# Altium schematic sheet Pwr management.SchDoc: Power management
size A4; CheckedBy: none; Organization: ORGANIZATION; Address1: ADDRESS 1; Address2: ADDRESS 2; Address3: ADDRESS 3; Address4: ADDRESS 4; Revision: -; SheetNumber: 2; SheetTotal: 5; ENG_APP_DATE: --/--/--; DSN_APP_DATE: --/--/--; CHK_APP_DATE: --/--/--
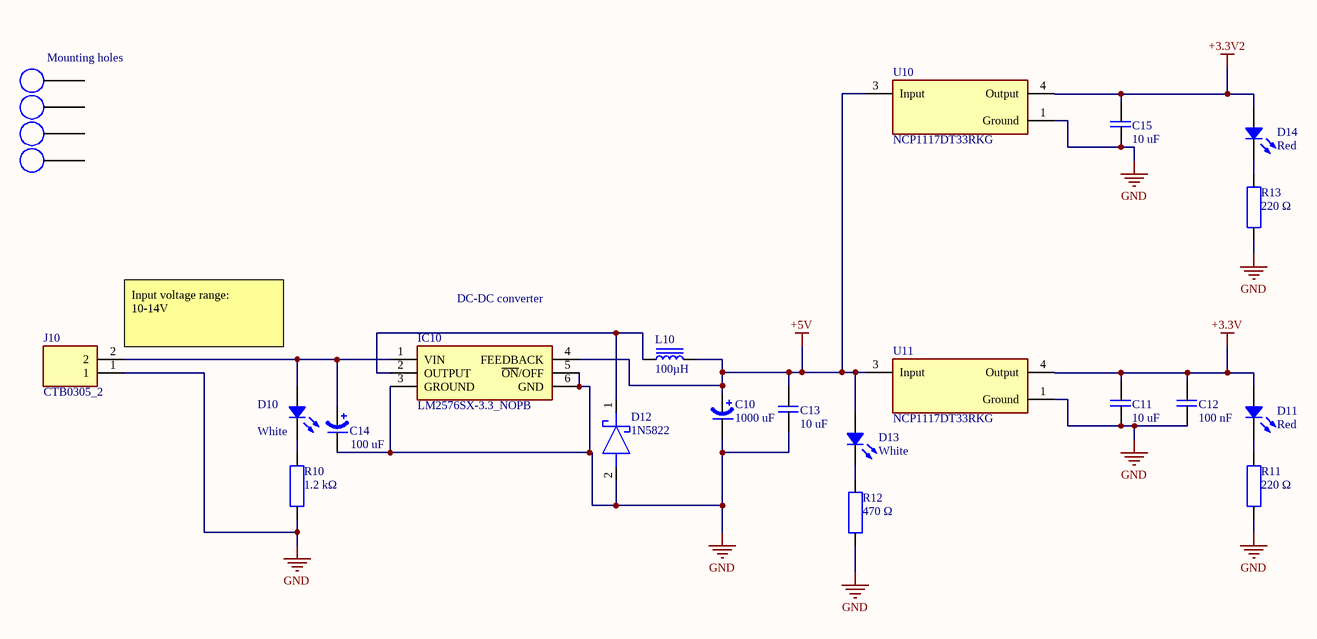
[diagram p0: Pwr management.SchDoc]

## Parts
C10  1000 uF  [Radial 13x20]
C11  10 uF  [1210 MLCC]
C12  100 nF  [1206 MLCC]
C13  10 uF  [1210 MLCC]
C14  100 uF  [RADIAL 8x11]
C15  10 uF  [1210 MLCC]
D10  White  [LED 1206_3216]
D11  Red  [LED 1206_3216]
D12  1N5822  [DIOAD2984W132L952D508]
D13  White  [LED 1206_3216]
D14  Red  [LED 1206_3216]
IC10  LM2576SX-3.3_NOPB  [KTT0005B]
J10  CTB0305_2  [CTB03052]
L10  100µH  [TDK SLF12575]
MH10  MH  [MH]  (value not drawn)  (no BOM)
MH11  MH  [MH]  (value not drawn)  (no BOM)
MH12  MH  [MH]  (value not drawn)  (no BOM)
MH13  MH  [MH]  (value not drawn)  (no BOM)
R10  1.2 kΩ  [1206 RES]
R11  220 Ω  [1206 RES]
R12  470 Ω  [1206 RES]
R13  220 Ω  [1206 RES]
U10  NCP1117DT33RKG  [FP-369C-MFG]
U11  NCP1117DT33RKG  [FP-369C-MFG]

## Nets
+3.3V: C11.2 C12.2 D11.1 U11.4(Output)
+3.3V2: C15.2 D14.1 U10.4(Output)
+5V: C10.1 C13.2 D13.1 IC10.4(FEEDBACK) L10.2 U10.3(Input) U11.3(Input)
GND: C10.2 C11.1 C12.1 C13.1 C14.2 C15.1 D12.2(A) IC10.3(GROUND) IC10.5(~{ON}/OFF) IC10.6(GND) J10.1 R10.2 R11.2 R12.2 R13.2 U10.1(Ground) U11.1(Ground)
NetC14_1: C14.1 D10.1 IC10.1(VIN) J10.2
NetD10_2: D10.2 R10.1
NetD11_2: D11.2 R11.1
NetD12_1: D12.1(K) IC10.2(OUTPUT) L10.1
NetD13_2: D13.2 R12.1
NetD14_2: D14.2 R13.1

Not connected (* = marked no-connect by the designer): MH10 1; MH11 1; MH12 1; MH13 1

## Notes on the sheet
- (near MH11) Mounting holes
- (near IC10) DC-DC converter
- (near J10) Input voltage range:
  10-14V
- Project:
- Title:
- Drawn by:
- Date and time:
- Checked by:
- Budapest University of Technology and Economics
- Faculty of Electrical Engineering and Informatics
- Sheet
- of
- Size:
- A4
- Revision:

## Library data of the parts
C10 C14 = Elco: Electrolytic capacitor
  C10: Value: 1000 uF
  C14: Value: 100 uF
C11-C13 C15 = Capacitor: Generic MLCC; Manufacturer article no.: *
  C11 C13 C15: Value: 10 uF
  C12: Value: 100 nF
D10 D11 D13 D14 = LTW-C230DS: LED WHITE 1206 SMD; Manufacturer: Lite-On Inc.; Configuration: Independent; Current - Test: 20mA; Lens Color: Yellow; Lens Size: 1.50mm x 1.60mm; Lens Style: Rectangle with Flat Top; Millicandela Rating: 315mcd; Viewing Angle: 130°; Voltage - Forward (Vf) (Typ): 3.2V; Part Number: LTW-C230DS; ComponentLink1Description: Datasheet; ComponentLink1URL: http://optoelectronics.liteon.com/upload/download/DS22-2007-0232/LTW-C230DS.pdf; ComponentLink2Description: DigiKey Link; ComponentLink2URL: http://digikey.com/product-detail/en/lite-on-inc/LTW-C230DS/160-2221-1-ND/7597462; Device Package: 1206 (3216 Metric); Height (Max): 1.10mm; LastUpdated: 2020. 09. 02. 1:22:59; Lifecycle Status: Active; Minimum Order: 1; Mounting Type: Surface Mount; Package / Case: 1206 (3216 Metric); Packaging: TapeAndReel; PartId: 933; Part Status: Active; Price: 0.13; Series: -; Size / Dimension: 3.20mm L x 1.60mm W; Supplier 1: DigiKey; Supplier Part Number 1: 160-2221-1-ND; Supplier Device Package: 1206
  D10 D13: Color: White; Value: White
  D11: Color: Red; Value: Red
  D14: Color: White; Value: Red
D12 = 1N5822: Schottky Diode; Manufacturer_Name: NEUTRAL; Datasheet Link: http://uk.rs-online.com/web/p/products/1124393; Manufacturer_Part_Number: 1N5822
IC10 = LM2576SX-3.3_NOPB: Integrated Circuit; Manufacturer_Name: Texas Instruments; Manufacturer_Part_Number: LM2576SX-3.3/NOPB; Datasheet Link: http://www.ti.com/lit/gpn/lm2576; Mouser Part Number: 926-LM2576SX33NOPB; Mouser Price/Stock: https://www.mouser.co.uk/ProductDetail/Texas-Instruments/LM2576SX-33-NOPB/?qs=X1J7HmVL2ZFzojdYFRsjwg%3D%3D; Arrow Part Number: LM2576SX-3.3/NOPB; Arrow Price/Stock: https://www.arrow.com/en/products/lm2576sx-3.3nopb/texas-instruments
J10 = CTB0305_2: Connector; Manufacturer_Name: CamdenBoss Ltd; Manufacturer_Part_Number: CTB0305/2; Datasheet Link: http://www.farnell.com/datasheets/2866628.pdf; Height: 9.1mm; Arrow Part Number: CTB0305/2; Arrow Price/Stock: https://www.arrow.com/en/products/ctb03052/camdenboss-ltd
L10 = SLF12575T-101M1R9-PF: FIXED IND 100UH 1.9A 125 MOHM; Manufacturer: TDK Corporation; DC Resistance (DCR): 150mOhm Max; Inductance Frequency - Test: 1kHz; Material - Core: Ferrite; Shielding: Shielded; Tolerance: ±20%; Type: Wirewound; Part Number: SLF12575T-101M1R9-PF; ComponentLink1Description: Datasheet; ComponentLink1URL: https://product.tdk.com/info/en/catalog/datasheets/inductor_commercial_power_slf12575_en.pdf?ref_disty=digikey; ComponentLink2Description: DigiKey Link; ComponentLink2URL: http://digikey.com/product-detail/en/tdk-corporation/SLF12575T-101M1R9-PF/445-174409-1-ND/5880183; Current Rating (Amps): 1.9A; Current - Saturation: 1.9A; Device Package: Nonstandard; Height - Seated (Max): 0.309" (7.85mm); Inductance: 100µH; LastUpdated: 2020. 09. 02. 1:22:14; Lifecycle Status: Active; Minimum Order: 1; Mounting Type: Surface Mount; Operating Temperature: -40°C ~ 105°C; Package / Case: Nonstandard; Packaging: TapeAndReel; PartId: 124; Part Status: Active; Price: 0.94; Series: SLF; Size / Dimension: 0.492" L x 0.492" W (12.50mm x 12.50mm); Supplier 1: DigiKey; Supplier Part Number 1: 445-174409-1-ND; Value: 100µH
MH10-MH13 = MH: Mounting hole
R10-R13 = Resitor: Generic SMD resistor
  R10: Value: 1.2 kΩ
  R11 R13: Value: 220 Ω
  R12: Value: 470 Ω
U10 U11 = CMP-07128-000036-1: IC REG LINEAR 3.3V 1A DPAK-3; Accuracy: 1%; Input Bias Current: 6mA; Min Input Voltage: 10V; Reference Voltage: 1.27V; Dropout Voltage: 1.07V; Number of Regulators: 1; Output Type: Fixed; Quiescent Current: 10mA; Max Input Voltage: 20V; Polarity: Positive; Packaging: Tape and Reel; Number of Pins: 3; Min Current Limit: 1A; Max Output Current: 1A; REACH SVHC: No SVHC; Nominal Output Voltage: 3.3V; Case/Package: DPAK; Min Output Voltage: 3.3V; Length: 6.73mm; Output Voltage Accuracy: 1%; Radiation Hardening: No; Min Operating Temperature: 0°C; Halogen Free: Halogen Free; Width: 6.22mm; Output Voltage: 3.3V; Height: 2.38mm; Lead Free: Lead Free; Output Current: 1A; Package Quantity: 1; Contact Plating: Tin; Number of Outputs: 1; Max Operating Temperature: 125°C; Mount: Surface Mount; Current Rating: 1A